# EAGLE design NwazetDAQLVModule (EAGLE 6.2)
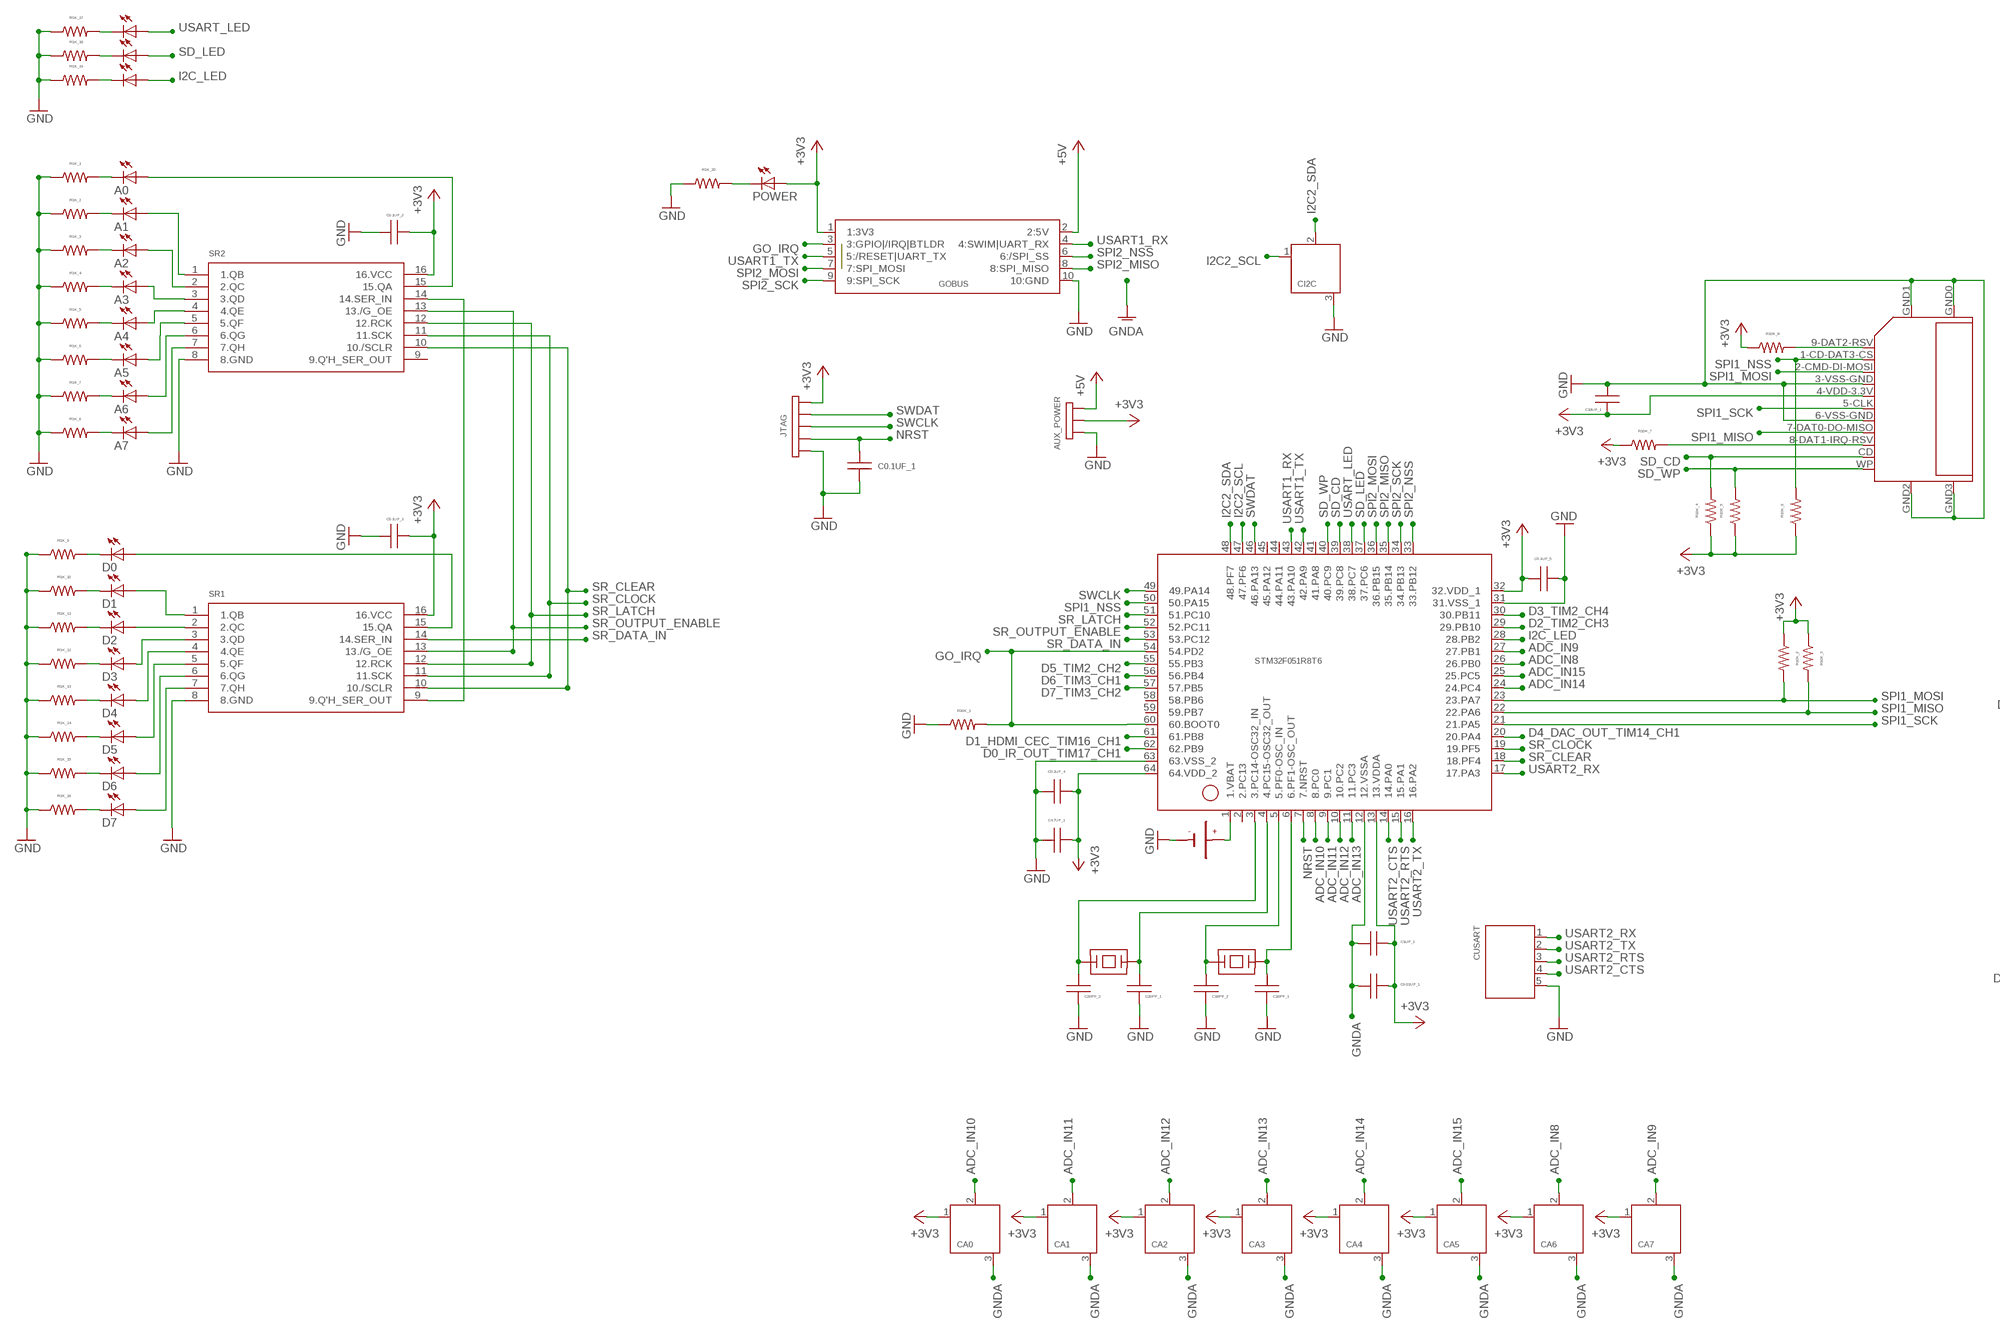
[diagram p0: schematic, sheet 1, part 1 of 2]
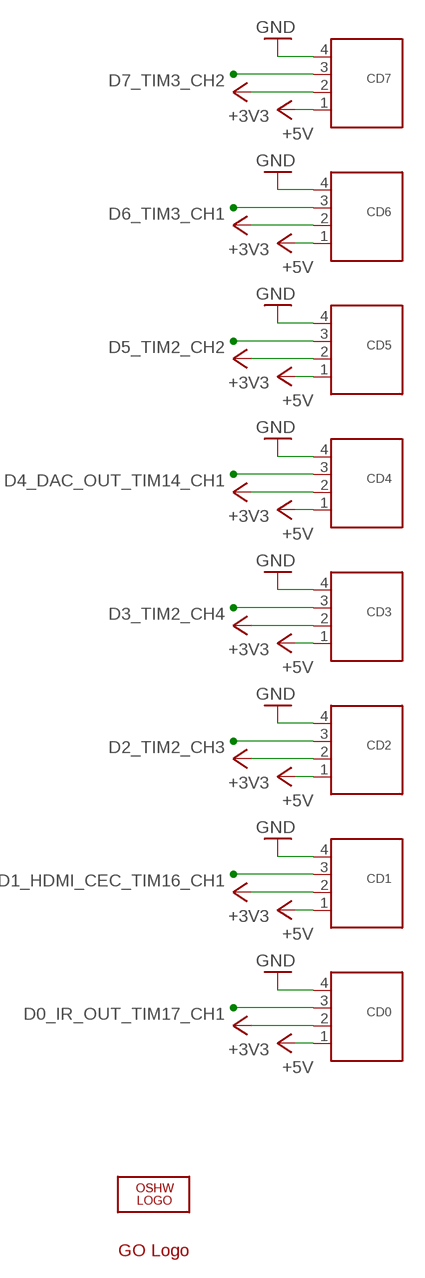
[diagram p1: schematic, sheet 1, part 2 of 2]

## Parts
A0  LITEON_WHITE_LED_0805  [0805]
A1  LITEON_WHITE_LED_0805  [0805]
A2  LITEON_WHITE_LED_0805  [0805]
A3  LITEON_WHITE_LED_0805  [0805]
A4  LITEON_WHITE_LED_0805  [0805]
A5  LITEON_WHITE_LED_0805  [0805]
A6  LITEON_WHITE_LED_0805  [0805]
A7  LITEON_WHITE_LED_0805  [0805]
AUX_POWER  POWER_HEADER_3V_5V_GND  [POWER_HEADER_3V_5V_GND]
C0.01UF_1  CAP_CER_0805  [0805_NO_POLARITY]
C0.1UF_1  CAP_CER_0805  [0805_NO_POLARITY]
C0.1UF_2  CAP_CER_0805  [0805_NO_POLARITY]
C0.1UF_3  CAP_CER_0805  [0805_NO_POLARITY]
C0.1UF_4  CAP_CER_0805  [0805_NO_POLARITY]
C0.1UF_5  CAP_CER_0805  [0805_NO_POLARITY]
C1UF_1  CAP_CER_0805  [0805_NO_POLARITY]
C4.7UF_1  CAP_CER_0805  [0805_NO_POLARITY]
C10UF_1  CAP_CER_0805  [0805_NO_POLARITY]
C18PF_1  CAP_CER_0805  [0805_NO_POLARITY]
C18PF_2  CAP_CER_0805  [0805_NO_POLARITY]
C20PF_1  CAP_CER_0805  [0805_NO_POLARITY]
C20PF_2  CAP_CER_0805  [0805_NO_POLARITY]
CA0  PHOENIX_CONTACT_PCB_TERMINAL_BLOCK_3_POS_1771101  [PHOENIX_CONTACT_PCB_TERMINAL_BLOCK_3_POSITIONS_1771101]
CA1  PHOENIX_CONTACT_PCB_TERMINAL_BLOCK_3_POS_1771101  [PHOENIX_CONTACT_PCB_TERMINAL_BLOCK_3_POSITIONS_1771101]
CA2  PHOENIX_CONTACT_PCB_TERMINAL_BLOCK_3_POS_1771101  [PHOENIX_CONTACT_PCB_TERMINAL_BLOCK_3_POSITIONS_1771101]
CA3  PHOENIX_CONTACT_PCB_TERMINAL_BLOCK_3_POS_1771101  [PHOENIX_CONTACT_PCB_TERMINAL_BLOCK_3_POSITIONS_1771101]
CA4  PHOENIX_CONTACT_PCB_TERMINAL_BLOCK_3_POS_1771101  [PHOENIX_CONTACT_PCB_TERMINAL_BLOCK_3_POSITIONS_1771101]
CA5  PHOENIX_CONTACT_PCB_TERMINAL_BLOCK_3_POS_1771101  [PHOENIX_CONTACT_PCB_TERMINAL_BLOCK_3_POSITIONS_1771101]
CA6  PHOENIX_CONTACT_PCB_TERMINAL_BLOCK_3_POS_1771101  [PHOENIX_CONTACT_PCB_TERMINAL_BLOCK_3_POSITIONS_1771101]
CA7  PHOENIX_CONTACT_PCB_TERMINAL_BLOCK_3_POS_1771101  [PHOENIX_CONTACT_PCB_TERMINAL_BLOCK_3_POSITIONS_1771101]
CD0  PHOENIX_CONTACT_PCB_TERMINAL_BLOCK_4_POS_1771114  [PHOENIX_CONTACT_PCB_TERMINAL_BLOCK_4_POSITIONS_1771114]
CD1  PHOENIX_CONTACT_PCB_TERMINAL_BLOCK_4_POS_1771114  [PHOENIX_CONTACT_PCB_TERMINAL_BLOCK_4_POSITIONS_1771114]
CD2  PHOENIX_CONTACT_PCB_TERMINAL_BLOCK_4_POS_1771114  [PHOENIX_CONTACT_PCB_TERMINAL_BLOCK_4_POSITIONS_1771114]
CD3  PHOENIX_CONTACT_PCB_TERMINAL_BLOCK_4_POS_1771114  [PHOENIX_CONTACT_PCB_TERMINAL_BLOCK_4_POSITIONS_1771114]
CD4  PHOENIX_CONTACT_PCB_TERMINAL_BLOCK_4_POS_1771114  [PHOENIX_CONTACT_PCB_TERMINAL_BLOCK_4_POSITIONS_1771114]
CD5  PHOENIX_CONTACT_PCB_TERMINAL_BLOCK_4_POS_1771114  [PHOENIX_CONTACT_PCB_TERMINAL_BLOCK_4_POSITIONS_1771114]
CD6  PHOENIX_CONTACT_PCB_TERMINAL_BLOCK_4_POS_1771114  [PHOENIX_CONTACT_PCB_TERMINAL_BLOCK_4_POSITIONS_1771114]
CD7  PHOENIX_CONTACT_PCB_TERMINAL_BLOCK_4_POS_1771114  [PHOENIX_CONTACT_PCB_TERMINAL_BLOCK_4_POSITIONS_1771114]
CI2C  PHOENIX_CONTACT_PCB_TERMINAL_BLOCK_3_POS_1771101  [PHOENIX_CONTACT_PCB_TERMINAL_BLOCK_3_POSITIONS_1771101]
CUSART  PHOENIX_CONTACT_PCB_TERMINAL_BLOCK_5_POS_1771127  [PHOENIX_CONTACT_PCB_TERMINAL_BLOCK_5_POSITIONS_1771127]
D0  LITEON_WHITE_LED_0805  [0805]
D1  LITEON_WHITE_LED_0805  [0805]
D2  LITEON_WHITE_LED_0805  [0805]
D3  LITEON_WHITE_LED_0805  [0805]
D4  LITEON_WHITE_LED_0805  [0805]
D5  LITEON_WHITE_LED_0805  [0805]
D6  LITEON_WHITE_LED_0805  [0805]
D7  LITEON_WHITE_LED_0805  [0805]
GOBUS  GO_CONNECTOR  [FCI-1.27X1.27MM_10PIN_HEADER_SHROUDED_SMT]
I2C_LED  LITEON_WHITE_LED_0805  [0805]
JTAG  PIN_HEADER_5_POSITIONS  [PIN_HEADER_5_POSITIONS]
L19  LITEON_WHITE_LED_0805  [0805]
LOGO1  OSHW_LOGO_8MILX0100-NT  [OSHW_8X100_NOTEXT]
POWER  LITEON_WHITE_LED_0805  [0805]
Q1_16MHZ  ABRACON_ABM7  [ABRACON_ABM7_CERAMIC_XTAL]
Q2_32.768KHZ  EPSON_MC306_32.768KHZ_CRYSTAL  [EPSON_MC306_32.768KHZ_CRYSTAL]
R1K_1  RESISTOR_0805  [0805_NO_POLARITY]
R1K_2  RESISTOR_0805  [0805_NO_POLARITY]
R1K_3  RESISTOR_0805  [0805_NO_POLARITY]
R1K_4  RESISTOR_0805  [0805_NO_POLARITY]
R1K_5  RESISTOR_0805  [0805_NO_POLARITY]
R1K_6  RESISTOR_0805  [0805_NO_POLARITY]
R1K_7  RESISTOR_0805  [0805_NO_POLARITY]
R1K_8  RESISTOR_0805  [0805_NO_POLARITY]
R1K_9  RESISTOR_0805  [0805_NO_POLARITY]
R1K_10  RESISTOR_0805  [0805_NO_POLARITY]
R1K_11  RESISTOR_0805  [0805_NO_POLARITY]
R1K_12  RESISTOR_0805  [0805_NO_POLARITY]
R1K_13  RESISTOR_0805  [0805_NO_POLARITY]
R1K_14  RESISTOR_0805  [0805_NO_POLARITY]
R1K_15  RESISTOR_0805  [0805_NO_POLARITY]
R1K_16  RESISTOR_0805  [0805_NO_POLARITY]
R1K_17  RESISTOR_0805  [0805_NO_POLARITY]
R1K_18  RESISTOR_0805  [0805_NO_POLARITY]
R1K_19  RESISTOR_0805  [0805_NO_POLARITY]
R1K_20  RESISTOR_0805  [0805_NO_POLARITY]
R10K_1  RESISTOR_0805  [0805_NO_POLARITY]
R10K_2  RESISTOR_0805  [0805_NO_POLARITY]
R10K_3  RESISTOR_0805  [0805_NO_POLARITY]
R10K_4  RESISTOR_0805  [0805_NO_POLARITY]
R10K_5  RESISTOR_0805  [0805_NO_POLARITY]
R10K_6  RESISTOR_0805  [0805_NO_POLARITY]
R10K_7  RESISTOR_0805  [0805_NO_POLARITY]
R10K_8  RESISTOR_0805  [0805_NO_POLARITY]
RTC_BATTERY  LINX_BAT-HLD-002-SMT  [LINX_CR2016_SMT_BATTERY_HOLDER]
SD_SOCKET  SD-101-00708-64-ND-V3  [SMD-SD-SOCKET]
SR1  MM74HC595  [TSSOP16]
SR2  MM74HC595  [TSSOP16]
STM32F051R8T6  STM32F051XXX  [STM32F051XXX_LPFP64]
U$2  GO_LOGO  [GO_LOGO]
USART_LED  LITEON_WHITE_LED_0805  [0805]

## Nets
1.VBAT: RTC_BATTERY.VBAT1(VBAT) STM32F051R8T6.1(1.VBAT)
10KPU1: R10K_8.2 SD_SOCKET.9-DAT2-RSV
10KPU2: R10K_7.2 SD_SOCKET.8-DAT1-IRQ-RSV
+3V3: AUX_POWER.+3V3 C0.01UF_1.1 C0.1UF_2.2 C0.1UF_3.2 C0.1UF_4.1 C0.1UF_5.2 C1UF_1.1 C4.7UF_1.1 C10UF_1.1 CA0.1 CA1.1 CA2.1 CA3.1 CA4.1 CA5.1 CA6.1 CA7.1 CD0.2 CD1.2 CD2.2 CD3.2 CD4.2 CD5.2 CD6.2 CD7.2 GOBUS.1(1:3V3) JTAG.1 POWER.A R10K_2.1 R10K_3.1 R10K_4.1 R10K_5.1 R10K_6.1 R10K_7.1 R10K_8.1 SD_SOCKET.4-VDD-3.3V SR1.16(16.VCC) SR2.16(16.VCC) STM32F051R8T6.13(13.VDDA) STM32F051R8T6.32(32.VDD_1) STM32F051R8T6.64(64.VDD_2)
+5V: AUX_POWER.+5V CD0.1 CD1.1 CD2.1 CD3.1 CD4.1 CD5.1 CD6.1 CD7.1 GOBUS.2(2:5V)
ADC_IN8: CA6.2 STM32F051R8T6.26(26.PB0)
ADC_IN9: CA7.2 STM32F051R8T6.27(27.PB1)
ADC_IN10: CA0.2 STM32F051R8T6.8(8.PC0)
ADC_IN11: CA1.2 STM32F051R8T6.9(9.PC1)
ADC_IN12: CA2.2 STM32F051R8T6.10(10.PC2)
ADC_IN13: CA3.2 STM32F051R8T6.11(11.PC3)
ADC_IN14: CA4.2 STM32F051R8T6.24(24.PC4)
ADC_IN15: CA5.2 STM32F051R8T6.25(25.PC5)
D0_IR_OUT_TIM17_CH1: CD0.3 STM32F051R8T6.62(62.PB9)
D1_HDMI_CEC_TIM16_CH1: CD1.3 STM32F051R8T6.61(61.PB8)
D2_TIM2_CH3: CD2.3 STM32F051R8T6.29(29.PB10)
D3_TIM2_CH4: CD3.3 STM32F051R8T6.30(30.PB11)
D4_DAC_OUT_TIM14_CH1: CD4.3 STM32F051R8T6.20(20.PA4)
D5_TIM2_CH2: CD5.3 STM32F051R8T6.55(55.PB3)
D6_TIM3_CH1: CD6.3 STM32F051R8T6.56(56.PB4)
D7_TIM3_CH2: CD7.3 STM32F051R8T6.57(57.PB5)
GND: AUX_POWER.GND C0.1UF_1.1 C0.1UF_2.1 C0.1UF_3.1 C0.1UF_4.2 C0.1UF_5.1 C4.7UF_1.2 C10UF_1.2 C18PF_1.1 C18PF_2.1 C20PF_1.1 C20PF_2.1 CD0.4 CD1.4 CD2.4 CD3.4 CD4.4 CD5.4 CD6.4 CD7.4 CI2C.3 CUSART.5 GOBUS.10(10:GND) JTAG.5 R1K_1.1 R1K_2.1 R1K_3.1 R1K_4.1 R1K_5.1 R1K_6.1 R1K_7.1 R1K_8.1 R1K_9.1 R1K_10.1 R1K_11.1 R1K_12.1 R1K_13.1 R1K_14.1 R1K_15.1 R1K_16.1 R1K_17.1 R1K_18.1 R1K_19.1 R1K_20.1 R10K_1.1 RTC_BATTERY.GND SD_SOCKET.3-VSS-GND SD_SOCKET.6-VSS-GND SD_SOCKET.GND0(GND-0) SD_SOCKET.GND1(GND-1) SD_SOCKET.GND2(GND-2) SD_SOCKET.GND3(GND-3) SR1.8(8.GND) SR2.8(8.GND) STM32F051R8T6.31(31.VSS_1) STM32F051R8T6.63(63.VSS_2)
GNDA: C0.01UF_1.2 C1UF_1.2 CA0.3 CA1.3 CA2.3 CA3.3 CA4.3 CA5.3 CA6.3 CA7.3 STM32F051R8T6.12(12.VSSA)
GO_IRQ: GOBUS.3(3:GPIO|/IRQ|BTLDR) R10K_1.2 STM32F051R8T6.54(54.PD2) STM32F051R8T6.60(60.BOOT0)
I2C2_SCL: CI2C.1 STM32F051R8T6.47(47.PF6)
I2C2_SDA: CI2C.2 STM32F051R8T6.48(48.PF7)
I2C_LED: I2C_LED.A STM32F051R8T6.28(28.PB2)
N$1: A0.A SR2.15(15.QA)
N$2: A1.A SR2.1(1.QB)
N$3: A2.A SR2.2(2.QC)
N$4: A3.A SR2.3(3.QD)
N$5: A4.A SR2.4(4.QE)
N$6: A6.A SR2.6(6.QG)
N$7: A5.A SR2.5(5.QF)
N$8: A7.A SR2.7(7.QH)
N$9: POWER.K(C) R1K_20.2
N$10: I2C_LED.K(C) R1K_19.2
N$11: D7.K(C) R1K_16.2
N$12: D6.K(C) R1K_15.2
N$13: D5.K(C) R1K_14.2
N$14: D0.K(C) R1K_9.2
N$15: D1.K(C) R1K_10.2
N$16: D2.K(C) R1K_11.2
N$17: D3.K(C) R1K_12.2
N$18: D0.A SR1.15(15.QA)
N$19: D4.K(C) R1K_13.2
N$20: D1.A SR1.1(1.QB)
N$21: D2.A SR1.2(2.QC)
N$22: A0.K(C) R1K_1.2
N$23: A1.K(C) R1K_2.2
N$24: A2.K(C) R1K_3.2
N$25: D3.A SR1.3(3.QD)
N$26: A3.K(C) R1K_4.2
N$27: D4.A SR1.4(4.QE)
N$28: D5.A SR1.5(5.QF)
N$29: D6.A SR1.6(6.QG)
N$30: D7.A SR1.7(7.QH)
N$31: A4.K(C) R1K_5.2
N$32: A5.K(C) R1K_6.2
N$33: A6.K(C) R1K_7.2
N$34: A7.K(C) R1K_8.2
N$65: SR1.9(9.Q'H_SER_OUT) SR2.14(14.SER_IN)
NRST: C0.1UF_1.2 JTAG.4 STM32F051R8T6.7(7.NRST)
OSC32_IN: C20PF_2.2 Q2_32.768KHZ.P$1 STM32F051R8T6.3(3.PC14-OSC32_IN)
OSC32_OUT: C20PF_1.2 Q2_32.768KHZ.P$4 STM32F051R8T6.4(4.PC15-OSC32_OUT)
OSC_IN: C18PF_2.2 Q1_16MHZ.P$1 STM32F051R8T6.5(5.PF0-OSC_IN)
OSC_OUT: C18PF_1.2 Q1_16MHZ.P$2 STM32F051R8T6.6(6.PF1-OSC_OUT)
RA5_R3: L19.K(C) R1K_18.2
RA5_R4: R1K_17.2 USART_LED.K(C)
SD_CD: R10K_4.2 SD_SOCKET.CD STM32F051R8T6.39(39.PC8)
SD_LED: L19.A STM32F051R8T6.37(37.PC6)
SD_WP: R10K_5.2 SD_SOCKET.WP STM32F051R8T6.40(40.PC9)
SPI1_MISO: R10K_3.2 SD_SOCKET.7-DAT0-DO-MISO STM32F051R8T6.22(22.PA6)
SPI1_MOSI: R10K_2.2 SD_SOCKET.2-CMD-DI-MOSI STM32F051R8T6.23(23.PA7)
SPI1_NSS: R10K_6.2 SD_SOCKET.1-CD-DAT3-CS STM32F051R8T6.50(50.PA15)
SPI1_SCK: SD_SOCKET.5-CLK STM32F051R8T6.21(21.PA5)
SPI2_MISO: GOBUS.8(8:SPI_MISO) STM32F051R8T6.35(35.PB14)
SPI2_MOSI: GOBUS.7(7:SPI_MOSI) STM32F051R8T6.36(36.PB15)
SPI2_NSS: GOBUS.6(6:/SPI_SS) STM32F051R8T6.33(33.PB12)
SPI2_SCK: GOBUS.9(9:SPI_SCK) STM32F051R8T6.34(34.PB13)
SR_CLEAR: SR1.10(10./SCLR) SR2.10(10./SCLR) STM32F051R8T6.18(18.PF4)
SR_CLOCK: SR1.11(11.SCK) SR2.11(11.SCK) STM32F051R8T6.19(19.PF5)
SR_DATA_IN: SR1.14(14.SER_IN) STM32F051R8T6.53(53.PC12)
SR_LATCH: SR1.12(12.RCK) SR2.12(12.RCK) STM32F051R8T6.51(51.PC10)
SR_OUTPUT_ENABLE: SR1.13(13./G_OE) SR2.13(13./G_OE) STM32F051R8T6.52(52.PC11)
SWCLK: JTAG.3 STM32F051R8T6.49(49.PA14)
SWDAT: JTAG.2 STM32F051R8T6.46(46.PA13)
USART1_RX: GOBUS.4(4:SWIM|UART_RX) STM32F051R8T6.43(43.PA10)
USART1_TX: GOBUS.5(5:/RESET|UART_TX) STM32F051R8T6.42(42.PA9)
USART2_CTS: CUSART.4 STM32F051R8T6.14(14.PA0)
USART2_RTS: CUSART.3 STM32F051R8T6.15(15.PA1)
USART2_RX: CUSART.1 STM32F051R8T6.17(17.PA3)
USART2_TX: CUSART.2 STM32F051R8T6.16(16.PA2)
USART_LED: STM32F051R8T6.38(38.PC7) USART_LED.A
Unconnected: SR2.9(9.Q'H_SER_OUT) STM32F051R8T6.2(2.PC13) STM32F051R8T6.41(41.PA8) STM32F051R8T6.44(44.PA11) STM32F051R8T6.45(45.PA12) STM32F051R8T6.58(58.PB6) STM32F051R8T6.59(59.PB7)

## Library data of the parts
A0 A1-A7 D0 D1-D7 I2C_LED L19 POWER USART_LED = Nwazet.Go:LITEON_WHITE_LED_0805
AUX_POWER = Nwazet.Go:POWER_HEADER_3V_5V_GND
C0.01UF_1 C0.1UF_1-C0.1UF_5 C1UF_1 C4.7UF_1 C10UF_1 C18PF_1 C18PF_2 C20PF_1 C20PF_2 = Nwazet.Go:CAP_CER_0805
CA0 CA1-CA7 CI2C = Nwazet.Go:PHOENIX_CONTACT_PCB_TERMINAL_BLOCK_3_POS_1771101
CD0 CD1-CD7 = Nwazet.Go:PHOENIX_CONTACT_PCB_TERMINAL_BLOCK_4_POS_1771114
CUSART = Nwazet.Go:PHOENIX_CONTACT_PCB_TERMINAL_BLOCK_5_POS_1771127
GOBUS = Nwazet.Go:GO_CONNECTOR
JTAG = Nwazet.Go:PIN_HEADER_5_POSITIONS
LOGO1 = ohw-logo:OSHW_LOGO_8MIL
Q1_16MHZ = Nwazet.Go:ABRACON_ABM7
Q2_32.768KHZ = Nwazet.Go:EPSON_MC306_32.768KHZ_CRYSTAL
R1K_1-R1K_20 R10K_1-R10K_8 = Nwazet.Go:RESISTOR_0805
RTC_BATTERY = Nwazet.Go:LINX_BAT-HLD-002-SMT
SD_SOCKET = Nwazet.Go:SD-101-00708-64-ND-V3
SR1 SR2 = Nwazet.Go:MM74HC595
STM32F051R8T6 = Nwazet.Go:STM32F051XXX
U$2 = Nwazet.Go:GO_LOGO

## Board
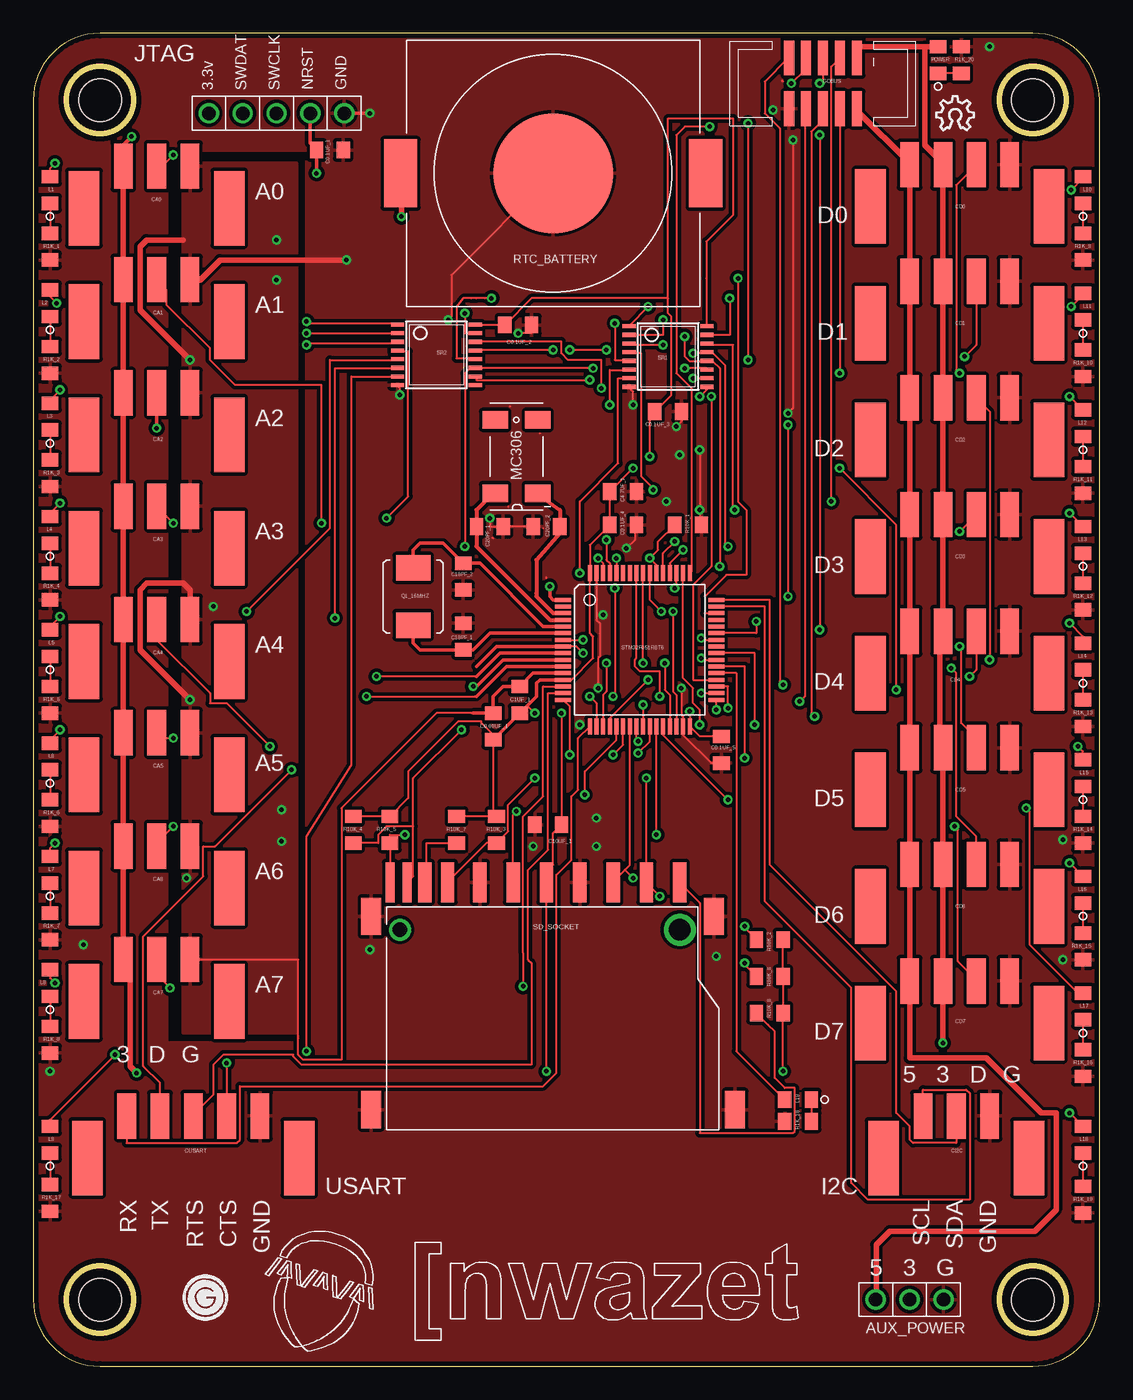
[diagram p2: board, top side]
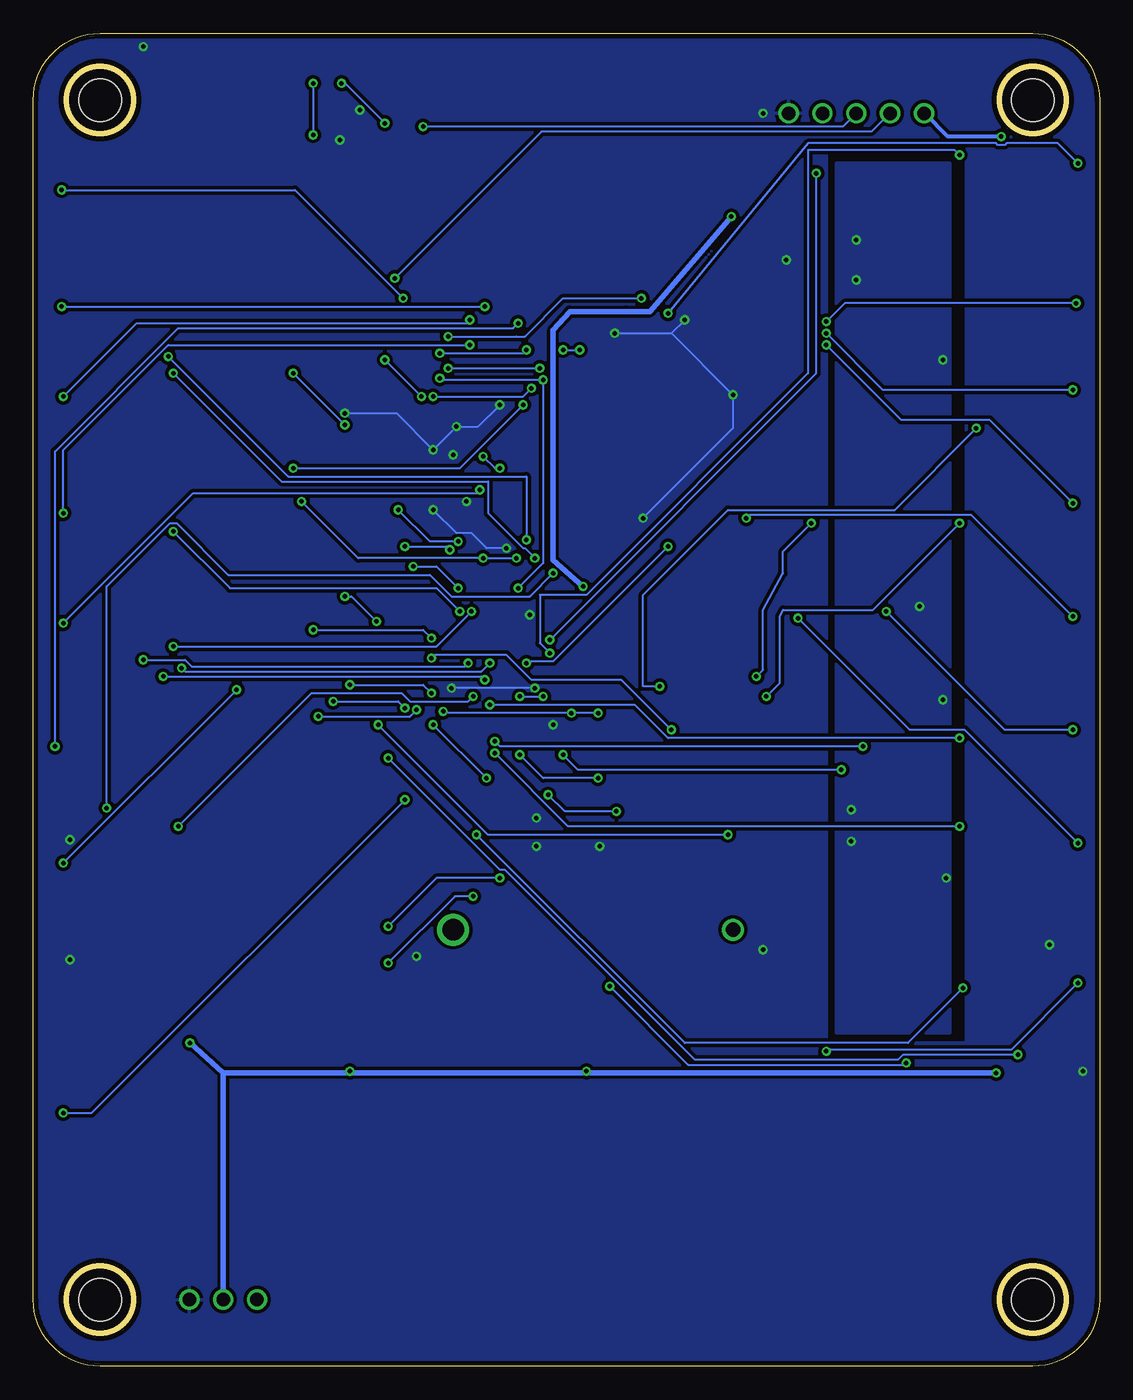
[diagram p3: board, bottom side, seen from below]

Size 80 x 100 mm. Coordinates in mm from the lower left corner, seen from the top.
Outline: 5,0 75,0 arc90 80,5 80,95 arc90 75,100 5,100 arc90 0,95 0,5 arc90 5,0
Outline: circle at 5,5 radius 2.5
Outline: circle at 75,5 radius 2.5
Outline: circle at 75,95 radius 2.5
Outline: circle at 5,95 radius 2.5
Copper layers (1*16): Top 0.0356mm / dielectric 1.5011mm / Bottom 0.0356mm
Design rules: minimum track width 6mil, minimum drill 13mil, track to track 6mil, track to pad 6mil, pad to pad 6mil, via to via 6mil, smd to smd 6mil, copper to edge 15mil, drill to drill 6mil, minimum pad ring 7mil, minimum via ring 7mil, stop-mask expansion 4mil, vias tented up to drill 0mil, thermal gap 10mil
Holes 3.2 mm at 5,5 5,95 75,95 75,5

### Footprints (pad centres in the part's own frame; a part is rotated, then mirrored left to right if it is on the bottom)
0805 = smd 1.25 x 1: A 0,1; K 0,-1
POWER_HEADER_3V_5V_GND = drill 1.016: +3V3 0,0; +5V -2.54,0; GND 2.54,0
0805_NO_POLARITY = smd 1.25 x 1: 1 0,1; 2 0,-1
PHOENIX_CONTACT_PCB_TERMINAL_BLOCK_3_POSITIONS_1771101 = smd 1.4 x 3.4: 1 -2.5,2.525; 2 0,2.525; 3 2.5,2.525 | smd 2.3 x 5.6: PAD1 -5.45,-0.625; PAD2 5.45,-0.625
PHOENIX_CONTACT_PCB_TERMINAL_BLOCK_4_POSITIONS_1771114 = smd 1.4 x 3.4: 1 -3.75,3.15; 2 -1.25,3.15; 3 1.25,3.15; 4 3.75,3.15 | smd 2.3 x 5.6: PAD1 -6.7,0; PAD2 6.7,0
PHOENIX_CONTACT_PCB_TERMINAL_BLOCK_5_POSITIONS_1771127 = smd 1.4 x 3.4: 1 -5,2.525; 2 -2.5,2.525; 3 0,2.525; 4 2.5,2.525; 5 5,2.525 | smd 2.3 x 5.6: PAD1 -7.95,-0.625; PAD2 7.95,-0.625
FCI-1.27X1.27MM_10PIN_HEADER_SHROUDED_SMT = smd 0.76 x 2.6: 1 -2.54,-1.905; 2 -2.54,1.905; 3 -1.27,-1.905; 4 -1.27,1.905; 5 0,-1.905; 6 0,1.905; 7 1.27,-1.905; 8 1.27,1.905; 9 2.54,-1.905; 10 2.54,1.905
PIN_HEADER_5_POSITIONS = drill 1.016: 1 -5.08,0; 2 -2.54,0; 3 0,0; 4 2.54,0; 5 5.08,0
ABRACON_ABM7_CERAMIC_XTAL = smd 1.9 x 2.6: P$1 -2.15,0; P$2 2.15,0
EPSON_MC306_32.768KHZ_CRYSTAL = smd 1.3 x 1.9: P$1 -2.75,-1.6; P$2 2.75,-1.6; P$3 2.75,1.6; P$4 -2.75,1.6
LINX_CR2016_SMT_BATTERY_HOLDER = smd 9 x 9: GND 0,0 | smd 2.5 x 5.1: VBAT1 -11.45,0; VBAT2 11.45,0
SMD-SD-SOCKET = smd 1 x 3: 1-CD-DAT3-CS -7,-3.55; 2-CMD-DI-MOSI -4.5,-3.55; 3-VSS-GND -2,-3.55; 4-VDD-3.3V 0.5,-3.55; 5-CLK 3,-3.55; 6-VSS-GND 5.5,-3.55; 7-DAT0-DO-MISO 7.92,-3.55; 8-DAT1-IRQ-RSV 9.62,-3.55; 9-DAT2-RSV -9.5,-3.55 | smd 0.7 x 3: CD 10.96,-3.55; WP 12.23,-3.55 | smd 1.5 x 2.8: GND0 -13.65,13.5; GND1 -12.07,-1; GND2 13.65,-1; GND3 13.65,13.5 | drill 1.6 pad 1.67: P$1 -9.5,0 | drill 1.1 pad 1.27: P$3 11.5,0
TSSOP16 = smd 0.305 x 0.991: 1 -2.275,-2.918; 2 -1.625,-2.918; 3 -0.975,-2.918; 4 -0.325,-2.918; 5 0.325,-2.918; 6 0.975,-2.918; 7 1.625,-2.918; 8 2.275,-2.918; 9 2.275,2.918; 10 1.625,2.918; 11 0.975,2.918; 12 0.325,2.918; 13 -0.325,2.918; 14 -0.975,2.918; 15 -1.625,2.918; 16 -2.275,2.918
STM32F051XXX_LPFP64 = smd 0.3 x 1.2: 1 -3.75,-5.75; 2 -3.25,-5.75; 3 -2.75,-5.75; 4 -2.25,-5.75; 5 -1.75,-5.75; 6 -1.25,-5.75; 7 -0.75,-5.75; 8 -0.25,-5.75; 9 0.25,-5.75; 10 0.75,-5.75; 11 1.25,-5.75; 12 1.75,-5.75; 13 2.25,-5.75; 14 2.75,-5.75; 15 3.25,-5.75; 16 3.75,-5.75; 33 3.75,5.75; 34 3.25,5.75; 35 2.75,5.75; 36 2.25,5.75; 37 1.75,5.75; 38 1.25,5.75; 39 0.75,5.75; 40 0.25,5.75; 41 -0.25,5.75; 42 -0.75,5.75; 43 -1.25,5.75; 44 -1.75,5.75; 45 -2.25,5.75; 46 -2.75,5.75; 47 -3.25,5.75; 48 -3.75,5.75 | smd 1.2 x 0.3: 17 5.75,-3.75; 18 5.75,-3.25; 19 5.75,-2.75; 20 5.75,-2.25; 21 5.75,-1.75; 22 5.75,-1.25; 23 5.75,-0.75; 24 5.75,-0.25; 25 5.75,0.25; 26 5.75,0.75; 27 5.75,1.25; 28 5.75,1.75; 29 5.75,2.25; 30 5.75,2.75; 31 5.75,3.25; 32 5.75,3.75; 49 -5.75,3.75; 50 -5.75,3.25; 51 -5.75,2.75; 52 -5.75,2.25; 53 -5.75,1.75; 54 -5.75,1.25; 55 -5.75,0.75; 56 -5.75,0.25; 57 -5.75,-0.25; 58 -5.75,-0.75; 59 -5.75,-1.25; 60 -5.75,-1.75; 61 -5.75,-2.25; 62 -5.75,-2.75; 63 -5.75,-3.25; 64 -5.75,-3.75

### Placement (x,y rotation side)
A0  1.25,88.25 0 top
A1  1.25,79.75 0 top
A2  1.25,71.25 0 top
A3  1.25,62.75 0 top
A4  1.25,54.25 0 top
A5  1.25,45.75 0 top
A6  1.25,37.25 0 top
A7  1.25,28.75 0 top
AUX_POWER  65.75,5 0 top
C0.01UF_1  34.5,48 180 top
C0.1UF_1  22.25,91.25 270 top
C0.1UF_2  36.38,78.12 270 top
C0.1UF_3  47.62,71.62 270 top
C0.1UF_4  44.25,63.12 90 top
C0.1UF_5  51.62,46.25 180 top
C1UF_1  36.5,50 180 top
C4.7UF_1  44.25,65.62 90 top
C10UF_1  38.62,40.62 270 top
C18PF_1  32.25,54.75 0 top
C18PF_2  32.25,59.25 180 top
C20PF_1  34.25,63 270 top
C20PF_2  38.5,63 90 top
CA0  9.25,87.5 0 top
CA1  9.25,79 0 top
CA2  9.25,70.5 0 top
CA3  9.25,62 0 top
CA4  9.25,53.5 0 top
CA5  9.25,45 0 top
CA6  9.25,36.5 0 top
CA7  9.25,28 0 top
CD0  69.5,87 0 top
CD1  69.5,78.25 0 top
CD2  69.5,69.5 0 top
CD3  69.5,60.75 0 top
CD4  69.5,52 0 top
CD5  69.5,43.25 0 top
CD6  69.5,34.5 0 top
CD7  69.5,25.75 0 top
CI2C  69.25,16.25 0 top
CUSART  12,16.25 0 top
D0  78.75,88.25 0 top
D1  78.75,79.5 0 top
D2  78.75,70.75 0 top
D3  78.75,62 0 top
D4  78.75,53.25 0 top
D5  78.75,44.5 0 top
D6  78.75,35.75 0 top
D7  78.75,27 0 top
GOBUS  59.25,96.25 180 top
I2C_LED  78.75,17 0 top
JTAG  18.25,94 0 top
L19  57.38,20 90 top
LOGO1  67.75,92.75 0 top
POWER  67.88,98 0 top
Q1_16MHZ  28.5,57.75 270 top
Q2_32.768KHZ  36.25,68.25 90 top
R1K_1  1.25,84 180 top
R1K_2  1.25,75.5 180 top
R1K_3  1.25,67 180 top
R1K_4  1.25,58.5 180 top
R1K_5  1.25,50 180 top
R1K_6  1.25,41.5 180 top
R1K_7  1.25,33 180 top
R1K_8  1.25,24.5 180 top
R1K_9  78.75,84 180 top
R1K_10  78.75,75.25 180 top
R1K_11  78.75,66.5 180 top
R1K_12  78.75,57.75 180 top
R1K_13  78.75,49 180 top
R1K_14  78.75,40.25 180 top
R1K_15  78.75,31.5 180 top
R1K_16  78.75,22.75 180 top
R1K_17  1.25,12.62 180 top
R1K_18  57.38,18.38 90 top
R1K_19  78.75,12.5 180 top
R1K_20  69.62,98 0 top
R10K_1  49.12,63.12 270 top
R10K_2  55.25,32 270 top
R10K_3  34.75,40.25 0 top
R10K_4  24,40.25 0 top
R10K_5  26.75,40.25 0 top
R10K_6  55.25,29.25 270 top
R10K_7  31.75,40.25 0 top
R10K_8  55.25,26.5 270 top
RTC_BATTERY  39,89.5 0 top
SD_SOCKET  39,32.75 180 top
SR1  47.62,75.75 270 top
SR2  30.25,75.88 270 top
STM32F051R8T6  45.5,53.75 270 top
U$2  13,5 0 top
USART_LED  1.25,17 0 top

### Tracks (layer width: path | path; a pad name or v marks a point on that pad's centre or on a via)
1.VBAT  (via drill 0.33)
  Top 0.152: 27.62,89.5 RTC_BATTERY.VBAT1
  Top 0.254: STM32F051R8T6.1 39,57.5 38.75,57.75 v38.75,58.5
  Top 0.406: v27.62,86.25 27.62,89.5
  Bottom 0.152: v27.62,86.25 v27.62,86.24
  Bottom 0.406: v38.75,58.5 41,60.5 41,77.75 39.75,79.12 35.5,79.12 33.75,79.12 v27.62,86.24
10KPU1
  Top 0.152: R10K_8.2 55.12,25.62 55.62,25.12 55.62,21.62 56.38,20.88 57.12,20.88 57.12,17.62 57,17.5 50,17.5 50,34.75 48.5,36.25 SD_SOCKET.9-DAT2-RSV
10KPU2
  Top 0.152: R10K_7.2 29.5,39.25 29.5,36.38 SD_SOCKET.8-DAT1-IRQ-RSV
+3V3  (via drill 0.33)
  Top 0.152: SR2.16 33.25,78.12 C0.1UF_2.2 37.38,80.12 47.62,80.12 | 47.62,80.12 47.62,79 47.88,78.75 47.88,72.88 C0.1UF_3.2 46.25,71.25 v46.25,68.25 | 47.62,80.12 47.62,93.62 48.5,93.62 52.5,93.62 52.5,86.38 50.5,84.38 50.5,81.62 50.5,78.12 SR1.16 | C0.1UF_5.2 50,47.25 STM32F051R8T6.32 v49.25,49.12 | 34.5,41.25 R10K_3.1 34.5,41.25 | 34.5,41.25 R10K_7.1 | R10K_4.1 R10K_5.1 28.12,42.62 28.12,44.62 31.88,48.38 33.62,48.38 33.62,48.25 34.62,47.25 C0.01UF_1.1 34.5,46.88 34.5,41.25 | v37.62,49 37.12,49.5 37.06,49.56 | STM32F051R8T6.13 39.88,51.5 40.38,51.5 42,53.12 42,54.75 41.75,55 STM32F051R8T6.64 41.75,61.62 C0.1UF_4.1 C4.7UF_1.1 v45,67.38 | v39.62,49 C10UF_1.1 39,40 39,37.62 38.5,37.12 38.5,36.38 SD_SOCKET.4-VDD-3.3V 38.5,36.25 v38.5,22.12 | 6.75,30.62 CA7.1 6.75,30.5 7.25,30 | 6.75,39 CA6.1 6.75,39.12 | 6.75,47.62 CA5.1 6.75,47.5 | 6.75,56 CA4.1 6.75,56.12 | 6.75,64.62 CA3.1 6.75,64.5 | 6.75,73 CA2.1 6.75,73.12 | 6.75,91.62 6.75,90.12 CA0.1 6.75,90 | 6.75,81.62 CA1.1 6.75,81.5 | 61.88,99 61.88,98.25 GOBUS.1 | R10K_2.1 R10K_6.1 R10K_8.1 v56.25,22.12 | 68.25,28.75 68.25,28.88 CD7.2 68.25,29 | 68.25,37.62 CD6.2 68.25,37.75 | 68.25,46.38 CD5.2 68,46.5 | 68,54.88 CD4.2 68.25,55.25 | 68.25,63.88 CD3.2 68.25,64 | 68.25,72.62 CD2.2 68.25,72.75 | 68.25,81.38 CD1.2 68.25,81.5 | 68.25,90.12 CD0.2 68.25,90.25
  Top 0.254: STM32F051R8T6.13 38,51.5 37.75,51.25 37.75,50.25 37.06,49.56 C1UF_1.1 C0.01UF_1.1
  Top 0.305: 6.75,91.62 v7.38,92.25
  Top 0.406: v68.25,24.25 68.25,28.75 | 6.75,39 6.75,30.62 | 6.75,56 6.75,47.62 | 6.75,47.5 6.75,39.12 | 6.75,73 6.75,64.62 | 6.75,90 6.75,81.62 | 6.75,81.5 6.75,73.12 | 6.75,64.5 6.75,56.12 | 61.88,99 66.88,99 | 66.88,99 POWER.A | 68.25,29 68.25,37.62 | 68.25,37.75 68.25,46.38 | 68,46.5 68,54.88 | 68.25,55.25 68.25,63.88 | 68.25,64 68.25,72.62 | 68.25,72.75 68.25,81.38 | 68.25,81.5 68.25,90.12 | 66.88,99 66.88,91.62 68.25,90.25 | 7.25,30 7.25,22.5 v7.75,22
  Bottom 0.152: v49.25,49.12 49.12,49 v39.62,49 v37.62,49 | v46.25,68.25 45.38,67.38 v45,67.38 | 13.12,94 JTAG.1 | v56.25,22.12 56.25,22 | v38.5,22.12 38.5,22 | 65.75,21.88 65.75,22
  Bottom 0.305: 13.12,94 11.38,92.25 v7.38,92.25
  Bottom 0.406: v7.75,22 38.5,22 56.25,22 65.75,22 v68.25,24.25 | 65.75,21.88 AUX_POWER.+3V3
+5V
  Top 0.152: 65.75,29 CD7.1 65.75,28.88 | 65.75,37.62 CD6.1 65.75,37.75 | 65.75,46.38 CD5.1 65.75,46.5 | 65.75,55.12 CD4.1 65.75,55.25 | 65.75,63.88 CD3.1 65.75,64 | 65.75,72.62 CD2.1 65.75,72.75 | 65.75,81.38 CD1.1 65.75,81.5 | GOBUS.2 61.75,94.38 61.75,94.25 | 65.75,90.12 CD0.1 | 63.25,5 AUX_POWER.+5V
  Top 0.406: 65.75,37.62 65.75,29 | 65.75,37.75 65.75,46.38 | 65.75,46.5 65.75,55.12 | 65.75,55.25 65.75,63.88 | 65.75,64 65.75,72.62 | 65.75,72.75 65.75,81.38 | 61.75,94.25 65.75,90.25 CD0.1 65.75,90.12 65.75,81.5 | 63.25,5 63.25,9.12 64.25,10.12 75.12,10.12 76.75,11.75 76.75,19 75.62,19 73.62,21 71.5,23.12 65.75,23.12 65.75,28.88
ADC_IN8  (via drill 0.33)
  Top 0.152: STM32F051R8T6.26 46.25,46.88 v45.38,46 | v10.5,40.5 9.25,39.25 9.25,39.12 CA6.2
  Bottom 0.152: v45.38,46 39.88,40.5 v10.5,40.5
ADC_IN9  (via drill 0.33)
  Top 0.152: v46.75,39.88 STM32F051R8T6.27 | v10.25,28.38 9.25,29.38 9.25,30.5 CA7.2
  Bottom 0.152: v46.75,39.88 31.12,24.25 14.38,24.25 v10.25,28.38
ADC_IN10  (via drill 0.33)
  Top 0.152: v41.25,53.5 40.75,54 39.88,54 STM32F051R8T6.8 | v10.5,90.88 9.75,90.12 9.25,90.12 CA0.2
  Top 0.254: STM32F051R8T6.8 34.75,54 33.25,52.5
  Bottom 0.152: v41.25,53.5 42,54.25 42,57.88 38.5,57.88 21.88,74.5 21.88,91.25 10.88,91.25 v10.5,90.88
ADC_IN11  (via drill 0.33)
  Top 0.152: v21.62,63.25 21.62,73.62 15.12,73.62 13.25,75.5 13.25,76.38 10,79.62 10,80.75 9.25,81.5 CA1.2 | v25.75,51.75 33.12,51.75 33.25,51.75
  Top 0.254: STM32F051R8T6.9 35,53.5 33.25,51.75
  Bottom 0.152: v25.75,51.75 25.25,52.25 25.25,56.75 23.75,59.5 23.75,61.12 v21.62,63.25
ADC_IN12  (via drill 0.33)
  Top 0.152: 9.25,73 CA2.2 | v33,51 33.12,51 33.25,51 | v9.25,70.38 9.25,70.5
  Top 0.254: 9.25,70.5 9.25,73 | STM32F051R8T6.10 35.25,53 33.25,51
  Bottom 0.152: v9.25,70.38 15.38,64.25 27.88,64.25 34.25,57.88 34.25,51 v33,51
ADC_IN13  (via drill 0.33)
  Top 0.152: v10.5,63.25 9.25,64.5 CA3.2 | 33.25,50.25 33.12,50.25 v25,50.25
  Top 0.254: STM32F051R8T6.11 35.5,52.5 33.25,50.25
  Bottom 0.152: v10.5,63.25 17,56.75 23.75,56.75 24,56.25 24,51.25 v25,50.25
ADC_IN14  (via drill 0.33)
  Top 0.152: STM32F051R8T6.24 45.25,47 v45.38,46.88 | v17.75,46.5 14.5,49.75 13.25,49.75 13.25,50.5 9.25,54.5 9.25,56 CA4.2
  Bottom 0.152: v45.38,46.88 45,46.5 v17.75,46.5
ADC_IN15  (via drill 0.33)
  Top 0.152: v45.75,49.62 STM32F051R8T6.25 | v10.5,47.12 9.25,47.12 9.25,47.5 CA5.2
  Bottom 0.152: v45.75,49.62 34.88,49.62 32.38,47.12 v10.5,47.12
D0_IR_OUT_TIM17_CH1  (via drill 0.33)
  Top 0.152: STM32F051R8T6.62 42.75,60.25 v42.38,60.62 | v69.5,74.5 69.25,74.75 69.25,88.62 70.75,90.12 CD0.3
  Bottom 0.152: v42.38,60.62 43.12,61.38 43.25,61.38 45.88,64 45.88,66.38 61.38,66.38 v69.5,74.5
D1_HDMI_CEC_TIM16_CH1  (via drill 0.33)
  Top 0.152: STM32F051R8T6.61 43.25,60.25 43,60.5 v43,62 | v69.88,75.75 70.75,76.62 70.75,81.38 CD1.3
  Bottom 0.152: v43,62 43,66.75 60.88,66.75 v69.88,75.75
D2_TIM2_CH3  (via drill 0.33)
  Top 0.152: STM32F051R8T6.29 47.75,50.38 47.38,50.75 v47.38,52.75 | v71.75,53 71.75,71.62 70.75,72.62 CD2.3
  Bottom 0.152: v47.38,52.75 47.62,52.5 68.12,52.5 68.62,53 v71.75,53
D3_TIM2_CH4  (via drill 0.33)
  Top 0.152: STM32F051R8T6.30 48.25,50.38 48,50.62 v48,56.62 | v69.5,62.62 70.75,63.88 CD3.3
  Bottom 0.152: v48,56.62 49.75,58.38 65.25,58.38 v69.5,62.62
D4_DAC_OUT_TIM14_CH1  (via drill 0.33)
  Top 0.152: STM32F051R8T6.20 43.25,48.62 v46.12,51.5 | v70.25,51.75 70.75,52.25 70.75,55.12 CD4.3
  Bottom 0.152: v46.12,51.5 46.38,51.75 v70.25,51.75
D5_TIM2_CH2  (via drill 0.33)
  Top 0.152: STM32F051R8T6.55 46.25,57.5 v47.12,56.62 | v69.5,54 69.62,53.88 69.62,48.25 70.75,47.12 70.75,46.5 CD5.3
  Bottom 0.152: v47.12,56.62 49.75,54 v69.5,54
D6_TIM3_CH1  (via drill 0.33)
  Top 0.152: v45.75,52.75 STM32F051R8T6.56 | v68.88,52.38 69.25,52 69.25,41.25 70.75,39.75 70.75,37.75 CD6.3
  Bottom 0.152: v45.75,52.75 46.38,52.12 68.62,52.12 v68.88,52.38
D7_TIM3_CH2  (via drill 0.33)
  Top 0.152: STM32F051R8T6.57 45.25,53.12 45.12,53 45.12,52.5 45.5,52.12 47,52.12 v47,50.25 | v69.12,40.5 69.38,40.25 69.38,30.38 70.75,29 CD7.3
  Bottom 0.152: v47,50.25 47.38,49.88 51.75,49.88 52.38,50.5 59.12,50.5 v69.12,40.5
GND  (via drill 0.33)
  Top 0.152: C0.1UF_5.1 50.88,45.25 48.75,47.38 STM32F051R8T6.31 48.75,48.75 48.62,48.88 v48.62,50.88 | v42.38,50.88 42.38,51.25 42.38,52.75 42.38,53.12 42.5,53.25 42.5,55 42.5,55.75 42.25,56 42.25,58.38 STM32F051R8T6.63 | C20PF_2.1 C20PF_1.1 | v27.5,72.88 27.5,73.38 27.38,73.5 SR2.8 | v36.38,77.5 37.38,77.5 C0.1UF_2.1 | C20PF_1.1 34.25,63 v34.25,63.62 | v45,72.12 45,73.12 44.75,73.38 SR1.8 | v48.25,70.5 48.62,70.88 C0.1UF_3.1 | R10K_1.1 50,63.25 v50,64.25 v50,68.75 | v56.62,71.5 57,71.88 v57,92 | v31.12,78.5 31.38,78.75 31.38,81.88 RTC_BATTERY.GND | R1K_2.1 1.25,74.38 | v44.5,61.38 45.12,62 45.12,63 C0.1UF_4.2 | 56.75,94.38 GOBUS.10 | 56.75,94.38 56.65,94.41 | 55.38,94.25 v55.5,94.25 | 55.38,94.25 v55.5,94.25 | 55.38,94.25 v55.5,94.25 | 55.38,94.25 v55.5,94.25 | 55.38,94.25 v55.5,94.25 | 55.38,94.25 v55.5,94.25 | 55.38,94.25 v55.5,94.25 | 55.38,94.25 v55.5,94.25 | 55.38,94.25 v55.5,94.25 | 55.38,94.25 v55.5,94.25 | 55.38,94.25 v55.5,94.25 | 55.38,94.25 v55.5,94.25 | 55.38,94.25 v55.5,94.25 | 55.38,94.25 v55.5,94.25 | 55.38,94.25 v55.5,94.25 | 55.38,94.25 v55.5,94.25 | 55.38,94.25 v55.5,94.25 | 56.75,94.38 GOBUS.10 | 56.75,94.38 56.65,94.41 | 56.75,94.38 GOBUS.10 | 56.75,94.38 56.65,94.41 | 56.75,94.38 GOBUS.10 | 56.75,94.38 56.65,94.41 | 56.75,94.38 GOBUS.10 | 56.75,94.38 56.65,94.41 | 56.75,94.38 GOBUS.10 | 56.75,94.38 56.65,94.41 | 56.75,94.38 GOBUS.10 | 56.75,94.38 56.65,94.41 | 56.75,94.38 GOBUS.10 | 56.75,94.38 56.65,94.41 | 56.75,94.38 GOBUS.10 | 56.75,94.38 56.65,94.41 | v55.5,94.25 55.5,94 55.51,94.01 | 55.38,94.25 v55.5,94.25 | 55.75,94.25 v55.5,94.25 | 55.38,94.25 v55.5,94.25 | 56.25,96.38 56.17,96.47 | 56.25,96.38 56.17,96.47 | 56.25,96.38 56.17,96.47
  Top 0.152: 56.25,96.38 56.17,96.47 | 56.25,96.38 56.17,96.47 | 56.25,96.38 56.17,96.47 | 56.25,96.38 56.17,96.47 | 56.25,96.38 56.17,96.47 | 56.25,96.38 56.17,96.47 | 56.25,96.38 56.17,96.47 | 56.25,96.38 56.17,96.47 | 56.25,96.38 56.17,96.47 | 56.25,96.38 56.17,96.47 | 56.25,96.38 56.17,96.47 | 56.25,96.38 56.17,96.47 | 56.25,96.38 56.17,96.47 | 56.25,96.38 56.17,96.47 | 56.25,96.38 56.17,96.47 | 56.25,96.38 56.17,96.47 | 56.25,96.38 56.17,96.47 | 56.25,96.38 56.17,96.47 | 56.25,96.38 56.17,96.47 | 56.25,96.38 56.17,96.47 | 56.25,96.38 56.17,96.47 | 56.25,96.38 56.17,96.47 | 56.25,96.38 56.17,96.47 | 56.25,96.38 56.17,96.47 | 56.25,96.38 56.17,96.47 | 56.25,96.38 56.17,96.47 | 56.25,96.38 56.17,96.47 | 56.25,96.38 56.17,96.47 | 56.25,96.38 56.17,96.47 | 56.25,96.38 56.17,96.47 | 56.25,96.38 56.17,96.47 | 56.25,96.38 56.17,96.47 | 56.25,96.38 56.17,96.47 | 56.25,96.38 56.17,96.47 | 56.25,96.38 56.17,96.47 | 56.25,96.38 56.17,96.47 | 56.25,96.38 56.17,96.47 | 56.25,96.38 56.17,96.47 | 56.25,96.38 56.17,96.47 | 56.25,96.38 56.17,96.47 | 56.25,96.38 56.17,96.47 | 56.25,96.38 56.17,96.47 | 56.25,96.38 56.17,96.47 | 56.25,96.38 56.17,96.47 | 56.25,96.38 56.17,96.47 | 56.25,96.38 56.17,96.47 | 56.25,96.38 56.17,96.47 | 56.25,96.38 56.17,96.47 | 56.25,96.38 56.17,96.47 | 56.25,96.38 56.17,96.47 | 56.25,96.38 56.17,96.47 | 56.25,96.38 56.17,96.47 | 56.25,96.38 56.17,96.47 | 56.25,96.38 56.17,96.47 | 56.25,96.38 56.17,96.47 | 56.25,96.38 56.17,96.47 | 56.25,96.38 56.17,96.47 | 56.25,96.38 56.17,96.47 | 56.25,96.38 56.17,96.47 | 55.38,94.25 v55.5,94.25 | 55.38,94.25 v55.5,94.25 | 55.38,94.25 v55.5,94.25 | 55.38,94.25 v55.5,94.25 | 55.38,94.25 v55.5,94.25 | 55.38,94.25 v55.5,94.25 | 55.38,94.25 v55.5,94.25
  Top 0.152: 55.38,94.25 v55.5,94.25 | 55.38,94.25 v55.5,94.25 | 55.38,94.25 v55.5,94.25 | 55.38,94.25 v55.5,94.25 | 55.38,94.25 v55.5,94.25 | 55.38,94.25 v55.5,94.25 | 55.38,94.25 v55.5,94.25 | 55.38,94.25 v55.5,94.25 | 55.38,94.25 v55.5,94.25 | 55.38,94.25 v55.5,94.25 | 55.38,94.25 v55.5,94.25 | 55.38,94.25 v55.5,94.25 | 55.38,94.25 v55.5,94.25 | 55.38,94.25 v55.5,94.25 | 56.25,96.38 56.17,96.47 | 56.25,96.38 56.17,96.47 | 56.75,94.38 GOBUS.10 | 56.75,94.38 56.65,94.41 | 56.75,94.38 GOBUS.10 | 56.75,94.38 56.65,94.41 | 56.75,94.38 GOBUS.10 | 56.75,94.38 56.65,94.41 | 56.75,94.38 GOBUS.10 | 56.75,94.38 56.65,94.41 | 56.75,94.38 GOBUS.10 | 56.75,94.38 56.65,94.41 | 56.75,94.38 GOBUS.10 | 56.75,94.38 56.65,94.41 | 56.75,94.38 GOBUS.10 | 56.75,94.38 56.65,94.41 | 56.75,94.38 GOBUS.10 | 56.75,94.38 56.65,94.41 | 55.38,94.25 v55.5,94.25 | 55.38,94.25 v55.5,94.25 | 34.5,62.12 34.45,62.14 | 34.5,62.12 34.45,62.14 | 34.5,62.12 34.45,62.14 | 34.5,62.12 34.45,62.14 | 34.5,62.12 34.45,62.14 | 34.5,62.12 34.45,62.14 | 38,70 38,69.97 | 38,70 38,69.97 | 38,70 38,69.97 | 38,70 38,69.97 | 38,70 38,69.97 | 38,70 38,69.97 | 38.25,62.88 | 38.25,62.88 | 38.25,62.88 | 38.25,62.88 | 38.25,62.88 | 38.25,62.88 | 34.5,62.12 34.45,62.14 | 34.5,62.12 34.45,62.14 | 34.5,62.12 34.45,62.14 | 34.5,62.12 34.45,62.14 | 34.5,62.12 34.45,62.14 | 34.5,62.12 34.45,62.14 | 34.5,62.12 34.45,62.14 | 34.5,62.12 34.45,62.14 | 34.5,62.12 34.45,62.14 | 34.5,62.12 34.45,62.14 | 34.5,62.12 34.45,62.14 | 34.5,62.12 34.45,62.14 | 34.5,62.12 34.45,62.14 | 34.5,62.12 34.45,62.14 | 38.5,59.12 38.48,59.17 | 38.5,59.12 38.48,59.17 | 38.5,59.12 38.48,59.17 | 38.5,59.12 38.48,59.17 | 34.5,62.12 34.45,62.14 | 34.5,62.12 34.45,62.14 | 34.5,62.12 34.45,62.14
  Top 0.152: 34.5,62.12 34.45,62.14 | 35.62,64.5 35.62,64.47 | 35.62,64.5 35.62,64.47 | 35.62,64.5 35.62,64.47 | 35.62,64.5 35.62,64.47 | 35.62,64.5 35.62,64.47 | 35.62,64.5 35.62,64.47 | 35.25,62.88 C20PF_1.1 | 35.25,62.88 C20PF_1.1 | 35.25,62.88 C20PF_1.1 | 35.75,72 35.77,72.02 | 35.75,72 35.77,72.02 | 35.75,72 35.77,72.02 | 35.75,72 35.77,72.02 | 35.75,72 35.77,72.02 | 35.75,72 35.77,72.02 | 37.62,62.88 C20PF_2.1 | 37.62,62.88 | 37.62,62.88 C20PF_2.1 | 37.62,62.88 | 37.62,62.88 C20PF_2.1 | 37.62,62.88 | 34.5,62.12 34.45,62.14 | 34.5,62.12 34.45,62.14 | 34.5,62.12 34.45,62.14 | 34.5,62.12 34.45,62.14 | 34.5,62.12 34.45,62.14 | 34.5,62.12 34.45,62.14 | 34.5,62.12 34.45,62.14 | 34.5,62.12 34.45,62.14
  Top 0.254: 23.25,94 v25.25,94
  Top 0.406: 11.75,81.5 12.5,81.5 14,83 v23.5,83
  Bottom 0.152: v42.38,50.88 v48.62,50.88 | 32.12,77.5 v27.5,72.88 27.5,70.38 v34.25,63.62 | v36.38,77.5 32.12,77.5 | v45,72.12 46.62,70.5 v48.25,70.5 v50,68.75 52.75,71.5 v56.62,71.5 | v31.12,78.5 32.12,77.5 | v50,64.25 48.25,62.5 47.12,62.5 46,61.38 v44.5,61.38
  other vias: 71.75,99 77.25,39.5 77.25,30.5 51.25,30.75 37.5,39 25.25,31.25 42.25,39 42.75,56.38 47.5,64.88 48.5,68.38 41,48.12 42.25,41.12 1.25,22.12 3.75,31.62
  pour Bottom (isolate 0.254): 20.5,100 5,100 arc90 0,95 0,91.25 20.5,91.25
  pour Bottom (isolate 0.254): 20.5,100 75,100 arc-90 80,95 80,5 arc-90 75,0 5.25,0 arc-90 0,5.25 0,24.25 20.5,24.25
  pour Top (isolate 0.254): 20.5,100 75,100 arc-90 80,95 80,5 arc-90 75,0 5,0 arc-90 0,5 0,24.25 20.5,24.25
  pour Top (isolate 0.254): 20.5,100 5,100 arc90 0,95 0,91.25 20.5,91.25
  pour Top (isolate 0.254): 0,91.25 10,91.25 10,24.25 0,24.25
  pour Bottom (isolate 0.254): 0,91.25 10,91.25 10,24.25 0,24.25
GNDA  (via drill 0.33)
  Top 0.152: 33,49 32.88,49 30.25,49 23.12,41.88 23.12,23 20.25,23 19.88,23.38 19.88,24.62 19.88,24.75 19.88,30.5 11.75,30.5 CA7.3
  Top 0.254: STM32F051R8T6.12 37.5,52 C1UF_1.2 35.25,51 34.5,50.25 C0.01UF_1.2 33,49
  Top 0.406: v11.75,50 8,53.75 8,58.25 8.5,58.75 11.25,58.75 11.75,58.25 11.75,56 | v11.75,75.5 8,79.25 8,84 8.5,84.5 11.25,84.5
  other vias: 13.5,57 18.25,84.5 18.25,81.5 11.5,36.62 18.62,41.75 18.62,39.38
  pour Bottom (isolate 0.254): 11.25,90.25 19.75,90.25 19.75,25 11.25,25
  pour Top (isolate 0.254): 11.25,90.25 19.75,90.25 19.75,25 11.25,25
GO_IRQ  (via drill 0.33)
  Top 0.152: v43.75,60.62 STM32F051R8T6.60 | STM32F051R8T6.54 46.75,60.12 v46.25,60.62 46.88,61.25 46.88,61.88 R10K_1.2 | v59.88,64.88 59.88,97.5 60.5,98.12 GOBUS.3
  Bottom 0.152: v43.75,60.62 v46.25,60.62 55.62,60.62 v59.88,64.88
I2C2_SCL
  Top 0.152: STM32F051R8T6.47 54.88,57 54.88,34.88 61.38,28.38 61.38,13.75 62.62,12.5 70.25,12.5 70.25,20.5 70,20.75 66.75,20.75 66.75,18.88 CI2C.1
I2C2_SDA
  Top 0.152: STM32F051R8T6.48 55.25,57.5 55.25,37.62 64.75,28.12 64.75,19 65.75,18 65.75,17 66,16.75 69.25,16.75 69.25,18.75 CI2C.2
I2C_LED  (via drill 0.33)
  Top 0.152: STM32F051R8T6.28 47.25,47.38 v52.12,42.5 | I2C_LED.A v77.75,19
  Bottom 0.152: v52.12,42.5 75.62,19 v77.75,19
N$1  (via drill 0.33)
  Top 0.152: v32.38,79 32.38,77.5 33.12,77.5 SR2.15 | v1.62,90.25 1.25,89.88 A0.A
  Bottom 0.152: v32.38,79 21.88,91.75 7.75,91.75 7.62,91.62 7.12,91.62 7,91.75 3.12,91.75 v1.62,90.25
N$2  (via drill 0.33)
  Top 0.152: v20.5,78.38 20.5,78.25 27.25,78.25 SR2.1 | v1.75,79.75 1.25,80.25 A1.A
  Bottom 0.152: v20.5,78.38 19.12,79.75 v1.75,79.75
N$3  (via drill 0.33)
  Top 0.152: v20.5,77.5 27.25,77.5 SR2.2 | v2,73.25 1.25,72.5 A2.A
  Bottom 0.152: v20.5,77.5 16.25,73.25 v2,73.25
N$4  (via drill 0.33)
  Top 0.152: v20.5,76.62 20.5,76.75 27.25,76.75 SR2.3 | v2,64.75 1.25,64 A3.A
  Bottom 0.152: v20.5,76.62 14.88,71 8.25,71 v2,64.75
N$5  (via drill 0.33)
  Top 0.152: v26.5,63.62 28.12,65.25 28.12,76.12 27.38,76.12 SR2.4 | v2,56.25 1.25,55.5 A4.A
  Bottom 0.152: v26.5,63.62 26.25,63.88 9.62,63.88 v2,56.25
N$6  (via drill 0.33)
  Top 0.152: v22.62,56.12 22.62,74.88 27.25,74.88 SR2.6 | v1.62,39.25 1.25,38.88 A6.A
  Bottom 0.152: v22.62,56.12 14.25,47.75 10.12,47.75 v1.62,39.25
N$7  (via drill 0.33)
  Top 0.152: v16,56.62 22.25,62.88 22.25,75.5 27.25,75.5 SR2.5 | v2,47.75 1.25,47 A5.A
  Bottom 0.152: v16,56.62 7.12,47.75 v2,47.75
N$8  (via drill 0.33)
  Top 0.152: v20.5,23.62 20.5,39.75 23.88,45.12 23.88,74.25 27.25,74.25 SR2.7 | v1.62,28.75 1.25,29.12 A7.A
  Bottom 0.152: v20.5,23.62 20.38,23.75 6.62,23.75 v1.62,28.75
N$9
  Top 0.152: R1K_20.2 POWER.K
N$10
  Top 0.152: I2C_LED.K R1K_19.2
N$11
  Top 0.152: D7.K R1K_16.2
N$12
  Top 0.152: D6.K R1K_15.2
N$13
  Top 0.152: D5.K R1K_14.2
N$14
  Top 0.152: D0.K R1K_9.2
N$15
  Top 0.152: D1.K R1K_10.2
N$16
  Top 0.152: D2.K R1K_11.2
N$17
  Top 0.152: D3.K R1K_12.2
N$18  (via drill 0.33)
  Top 0.152: v52.25,80.12 52.25,77.38 50.62,77.38 SR1.15 | v77.88,88.25 78.75,89.12 D0.A
  Bottom 0.152: v52.25,80.12 60.38,88.25 v77.88,88.25
N$19
  Top 0.152: D4.K R1K_13.2
N$20  (via drill 0.33)
  Top 0.152: v46.12,79.5 44.75,78.12 SR1.1 | v77.88,79.5 78.75,80.38 D1.A
  Bottom 0.152: v77.88,79.5 v46.12,79.5
N$21  (via drill 0.33)
  Top 0.152: v47.25,78.5 47.25,77.38 44.75,77.38 SR1.2 | D2.A v77.75,72.75
  Bottom 0.152: v47.25,78.5 47.5,78.25 72.25,78.25 v77.75,72.75
N$22
  Top 0.152: A0.K R1K_1.2
N$23
  Top 0.152: A1.K R1K_2.2
N$24
  Top 0.152: A2.K R1K_3.2
N$25  (via drill 0.33)
  Top 0.152: v47.25,76.62 44.75,76.62 SR1.3 | D3.A v77.75,64
  Bottom 0.152: v47.25,76.62 69.88,76.62 77.75,68.75 v77.75,64
N$26
  Top 0.152: A3.K R1K_4.2
N$27  (via drill 0.33)
  Top 0.152: v46.5,65.75 46.5,65.88 45.62,66.75 45.62,76 44.75,76 SR1.4 | v77.75,55.75 78.75,54.75 D4.A
  Bottom 0.152: v46.5,65.75 46.75,65.5 68,65.5 v77.75,55.75
N$28  (via drill 0.33)
  Top 0.152: v43.62,78.25 43.62,75.5 44.62,75.5 SR1.5 | v78.38,46.5 78.75,46.12 D5.A
  Bottom 0.152: v43.62,78.25 44,77.88 69.12,77.88 78.38,68.62 v78.38,46.5
N$29  (via drill 0.33)
  Top 0.152: v43.25,72.12 43.25,74.75 44.62,74.75 SR1.6 | v60.5,67.38 64.75,63.12 v64.75,50.75 | D6.A v77.75,37.75
  Bottom 0.152: v43.25,72.12 48,67.38 v60.5,67.38 | v77.75,37.75 v64.75,50.75
N$30  (via drill 0.33)
  Top 0.152: v41,59.5 41,64.88 43.88,67.75 43.88,74.12 44.62,74.12 SR1.7 | v74.5,41.88 74.75,41.62 74.75,31.62 78.38,28 D7.A
  Bottom 0.152: v41,59.5 42.75,57.75 48.62,57.75 50.25,59.38 65.38,59.38 69.25,63.25 69.75,63.25 74.5,58.5 v74.5,41.88
N$31
  Top 0.152: A4.K R1K_5.2
N$32
  Top 0.152: A5.K R1K_6.2
N$33
  Top 0.152: A6.K R1K_7.2
N$34
  Top 0.152: A7.K R1K_8.2
N$65  (via drill 0.33)
  Top 0.152: v42.62,73.38 42.62,75.5 40.12,75.5 39.62,76 39.62,76.88 33.25,76.88 SR2.14 | v50,72.75 50.5,73.25 50.5,73.38 SR1.9
  Bottom 0.152: v42.62,73.38 43.25,72.75 v50,72.75
NRST  (via drill 0.33)
  Top 0.152: STM32F051R8T6.7 v41.25,54.5 | JTAG.4 20.88,94 20.75,94
  Top 0.254: v21.25,89.5 C0.1UF_1.2 20.75,91.75 20.75,94
  Bottom 0.152: v41.25,54.5 21.25,74.5 v21.25,89.5
OSC32_IN
  Top 0.152: Q2_32.768KHZ.P$1 37.88,65.5 37.83,65.44
  Top 0.305: 37.75,65.5 37.83,65.44 39.5,64.25 C20PF_2.2 39.5,62.5 37.75,60.5 37.75,58 37.75,57.75 38.75,56.75 39,56.5 STM32F051R8T6.3
OSC32_OUT
  Top 0.152: Q2_32.768KHZ.P$4 34.62,65.5 34.5,65.5
  Top 0.305: 34.75,65.5 Q2_32.768KHZ.P$4 34.62,65.5 34.5,65.5 33.25,64.25 C20PF_1.2 33.25,61.5 37.75,57 38,56.75 38.75,56 STM32F051R8T6.4
OSC_IN
  Top 0.152: Q1_16MHZ.P$1 28.5,59.88 28.5,60
  Top 0.254: 28.5,60 28.5,61.25 29,61.75 30.75,61.75 C18PF_2.2 33.5,60.25 38.25,55.5 STM32F051R8T6.5
OSC_OUT
  Top 0.152: Q1_16MHZ.P$2 28.5,55.62 28.5,55.5
  Top 0.254: 28.5,55.5 28.5,54.25 29,53.75 C18PF_1.2 33,53.75 34.25,55 STM32F051R8T6.6
RA5_R3
  Top 0.152: L19.K R1K_18.2
RA5_R4
  Top 0.152: USART_LED.K R1K_17.2
SD_CD  (via drill 0.33)
  Top 0.152: STM32F051R8T6.39 50.12,53 v50.12,53.12 | v32.12,47.75 28.5,44.12 28.5,40.5 | 28.5,40.5 28.5,36.75 28.12,36.38 SD_SOCKET.CD | R10K_4.2 25.88,39.25 25.88,39.88 26.5,40.5 28.5,40.5
  Bottom 0.152: v50.12,53.12 49.88,53.38 44.5,53.38 42.62,51.5 35.88,51.5 v32.12,47.75
SD_LED
  Top 0.152: STM32F051R8T6.37 52.75,52 52.75,23.62 L19.A
SD_WP  (via drill 0.33)
  Top 0.152: STM32F051R8T6.40 54.12,53.5 v54.12,48.12 | v27.88,39.88 26.75,39.88 R10K_5.2 26.75,36.38 SD_SOCKET.WP
  Bottom 0.152: v54.12,48.12 45.88,39.88 v27.88,39.88
SPI1_MISO  (via drill 0.33)
  Top 0.152: STM32F051R8T6.22 44.25,46.62 v43.5,45.88 | v37.62,44.12 35.62,42.12 35.62,40.12 R10K_3.2 34,39.25 31.12,36.38 SD_SOCKET.7-DAT0-DO-MISO
  Bottom 0.152: v43.5,45.88 41.75,44.12 v37.62,44.12
SPI1_MOSI  (via drill 0.33)
  Top 0.152: STM32F051R8T6.23 44.75,37.62 44.38,37.25 | 44.38,37.25 43.5,36.38 SD_SOCKET.2-CMD-DI-MOSI | R10K_2.2 53.38,32.88 v53.38,33 | 44.38,37.25 v45,36.62
  Bottom 0.152: v53.38,33 49.75,36.62 v45,36.62
SPI1_NSS  (via drill 0.33)
  Top 0.152: STM32F051R8T6.50 48.75,51.62 49.5,50.88 49.5,49.75 50,49.25 v50,48.12 | v46,44.12 46,36.38 SD_SOCKET.1-CD-DAT3-CS 46,36.25 v47,35.25 | R10K_6.2 53.38,30.12 v53.38,30.25
  Bottom 0.152: v46,44.12 v50,48.12 | v53.38,30.25 48.38,35.25 v47,35.25
SPI1_SCK  (via drill 0.33)
  Top 0.152: STM32F051R8T6.21 43.75,47 41.38,44.62 v41.38,42.88 | v36.25,41.62 36,41.38 36,36.38 SD_SOCKET.5-CLK
  Bottom 0.152: v41.38,42.88 40.12,41.62 v36.25,41.62
SPI2_MISO  (via drill 0.33)
  Top 0.152: STM32F051R8T6.35 52.12,51 v52.12,49.38 | v57.5,49.88 57.88,50.25 57.88,94.25 GOBUS.8
  Bottom 0.152: v52.12,49.38 52.62,49.88 v57.5,49.88
SPI2_MOSI  (via drill 0.33)
  Top 0.152: STM32F051R8T6.36 49.5,51.5 49.5,58.62 50.88,60 v50.88,72.75 | v53.62,93.25 v53.62,75.5 | v56.88,96.25 57.88,97.25 57.88,98.12 GOBUS.7
  Bottom 0.152: v53.62,75.5 v50.88,72.75 | v53.62,93.25 56.62,96.25 v56.88,96.25
SPI2_NSS  (via drill 0.33)
  Top 0.152: v51.25,49.25 STM32F051R8T6.33 | v58.62,48.75 58.38,49 58.38,92.62 59.25,93.5 59.25,94.25 GOBUS.6
  Bottom 0.152: v51.25,49.25 51.75,48.75 v58.62,48.75
SPI2_SCK  (via drill 0.33)
  Top 0.152: v50.12,50.5 STM32F051R8T6.34 | v56.25,51.12 56,51.38 56,92.88 54.88,94 54.88,96.38 56.62,98.12 GOBUS.9
  Bottom 0.152: v50.12,50.5 50.75,51.12 v56.25,51.12
SR_CLEAR  (via drill 0.33)
  Top 0.152: v49.5,74.12 50.5,74.12 SR1.10 | v41.75,74 33.25,74 33.25,74.25 SR2.10 | STM32F051R8T6.18 42.25,49.75 v41.75,50.25 | v43.5,50.25 43.62,50.38 v43.62,58.38
  Bottom 0.152: v49.5,74.12 49.38,74 v41.75,74 41.75,60.25 v43.62,58.38 | v43.5,50.25 v41.75,50.25
SR_CLOCK  (via drill 0.33)
  Top 0.152: v42,74.88 33.25,74.88 SR2.11 33.12,74.88 32.75,74.88 32.38,74.5 v32.38,61.5 | v48.88,74.88 50.5,74.88 SR1.11 | STM32F051R8T6.19 42.75,50.38 43,50.62 v43,52.75
  Bottom 0.152: v48.88,74.88 v42,74.88 | v43,52.75 42.88,52.88 41,52.88 v32.38,61.5
SR_DATA_IN  (via drill 0.33)
  Top 0.152: v52.62,64.25 52.5,64.38 52.5,76.62 50.62,76.62 SR1.14 | v48.12,61.88 47.25,61 STM32F051R8T6.53
  Bottom 0.152: v52.62,64.25 50.25,61.88 v48.12,61.88
SR_LATCH  (via drill 0.33)
  Top 0.152: v34.38,80.12 33.88,80.12 33.25,80.12 32.88,80.12 32.25,80.12 31.75,79.5 31.75,75.62 33.12,75.62 SR2.12 | v48.88,77.25 48.88,75.75 49.25,75.38 50.5,75.38 SR1.12 50.62,75.38 51,75.38 51.5,74.88 v51.5,60 | STM32F051R8T6.51 48.25,58.5 v48.12,58.38
  Bottom 0.152: v34.38,80.12 40.25,80.12 43.12,77.25 43.75,77.25 v48.88,77.25 | v48.12,58.38 49.75,60 v51.5,60
SR_OUTPUT_ENABLE  (via drill 0.33)
  Top 0.152: v39,76.25 33.25,76.25 SR2.13 | v43,76.25 v40.25,76.25 | v49.5,76 50.5,76 SR1.13 50.62,76 51,76 51.88,75.12 51.88,61.75 v52.12,61.5 | STM32F051R8T6.52 47.75,60.25 v48.75,61.25
  Bottom 0.152: v40.25,76.25 v39,76.25 | v43,76.25 43.25,76 v49.5,76 | v48.75,61.25 49,61.5 v52.12,61.5
SWCLK  (via drill 0.33)
  Top 0.152: STM32F051R8T6.49 49.38,59.62 49.38,73.38 48.25,74.5 48.25,92.38 48.88,93 v50.75,93
  Bottom 0.152: v50.75,93 19.25,93 JTAG.3
SWDAT  (via drill 0.33)
  Top 0.152: STM32F051R8T6.46 50.38,56.5 50.38,57.75 52,59.38 53.5,59.38 53.5,64.25 52.88,64.88 v52.88,81.62
  Bottom 0.152: v52.88,81.62 41.88,92.62 17.12,92.62 15.75,94 JTAG.2
USART1_RX  (via drill 0.33)
  Top 0.152: STM32F051R8T6.43 54.25,55 v54.25,55.88 | v56.62,70.62 v56.62,57.75 | v60.5,74.5 60.5,94.25 GOBUS.4
  Bottom 0.152: v54.25,55.88 56.12,57.75 v56.62,57.75 | v60.5,74.5 v56.62,70.62
USART1_TX  (via drill 0.33)
  Top 0.152: STM32F051R8T6.42 50.12,54.5 v50.12,54.62 | v59,92.38 v59,55.25 | v59,96.25 59.25,96.5 59.25,98.12 GOBUS.5
  Bottom 0.152: v50.12,54.62 50.75,55.25 v59,55.25 | v59,96.25 v59,92.38
USART2_CTS  (via drill 0.33)
  Top 0.152: STM32F051R8T6.14 38.25,51 38.25,42.75 36.75,41.25 36.75,31 v36.75,28.5 | v14.5,22.75 14.5,18.88 CUSART.4
  Bottom 0.152: v14.5,22.75 14.62,22.62 30.88,22.62 v36.75,28.5
USART2_RTS
  Top 0.152: STM32F051R8T6.15 38.62,50.5 38.62,38.75 37.12,37.25 37.12,30.5 37.38,30.25 37.38,22.62 20.12,22.62 19.5,23.25 19.5,23.38 14.25,23.38 13.5,22.62 13.5,20.38 12,18.88 CUSART.3
USART2_RX
  Top 0.152: STM32F051R8T6.17 40.88,47.12 40.88,43.25 40.38,42.75 40.38,38 39.25,36.88 39.25,22 38.25,21 15.5,21 15.5,17 15.25,16.75 7,16.75 7,18.75 CUSART.1
USART2_TX  (via drill 0.33)
  Top 0.152: STM32F051R8T6.16 40.25,49.5 v40.25,45.88 | v19.38,44.75 13.62,39 12.75,39 12.75,36.75 8.25,32.25 8.25,22.5 9.5,21.25 9.5,18.88 CUSART.2
  Bottom 0.152: v40.25,45.88 39.12,44.75 v19.38,44.75
USART_LED  (via drill 0.33)
  Top 0.152: STM32F051R8T6.38 53.38,52.5 v53.38,45.62 | v6.12,23.38 1.25,18.5 USART_LED.A
  Bottom 0.152: v53.38,45.62 45,37.25 44.62,37.25 30.38,23 15.12,23 14.75,23.38 v6.12,23.38

### Text on the board
tPlace: 3.3v | SWDAT | SWCLK | NRST | GND | L1 | A0 | L10 | D0 | L2 | A1 | L11 | D1 | L3 | L12 | A2 | D2 | L4 | A3 | L13 | D3 | L5 | A4 | L14 | D4 | L6 | A5 | L15 | D5 | L7 | A6 | L16 | D6 | SD_SOCKET | L8 | A7 | L17 | D7 | L9 | L18 | I2C | RX | TX | RTS | CTS | SCL | SDA | GND
tNames: 3 | D | G | 5 | 3 | D | G | USART | GND | 5 | 3 | G